# Altium schematic sheet [02] - HAB.SchDoc: HAB
size 433 x 279 mm; Author: ZAG; DrawnBy: ZAG; SheetNumber: 2; SheetTotal: 4; PageSetup: Record=PageOptions|CenterHorizontal=True|CenterVertical=True|PrintScale=0.96|XCorrection=1.00|YCorrection=1.00|PrintKind=2|BorderSize=5000000|LeftOffset=0|BottomOffset=0|Orientation=2|PaperLength=4318|PaperWidth=2794|Scale=100|PaperSource=15|PrintQuality=600|MediaType=1|DitherType=10|PaperKind=11x17|PrintScaleMode=1; SchRevision: 01; PCBRevision: 01; Project: HIGH ALTITUDE BALLOON; SchStatus: PRELIMINARY
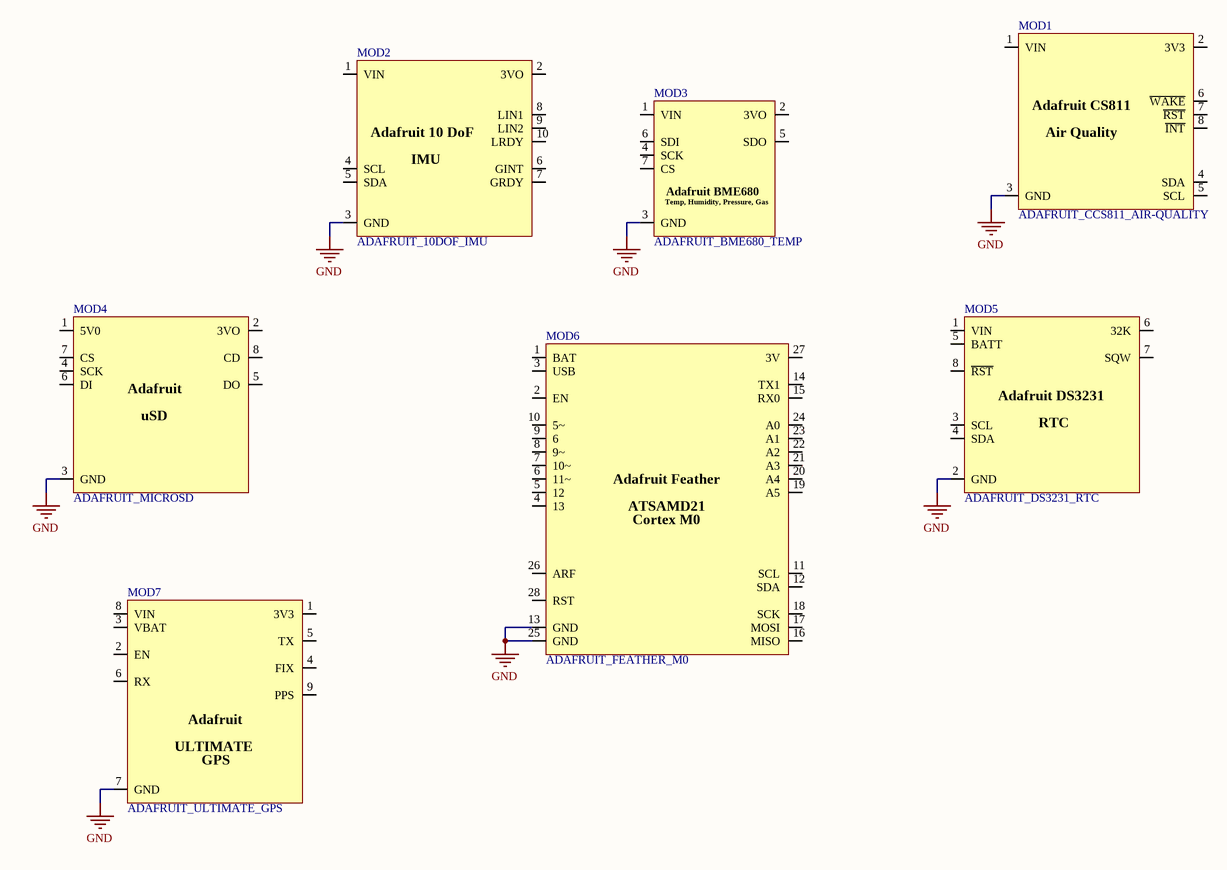
[diagram p0: [02] - HAB.SchDoc]

## Parts
MOD1  ADAFRUIT_CCS811_AIR-QUALITY  [ADAFRUIT_CCS811_AIR-QUALITY]
MOD2  ADAFRUIT_10DOF_IMU  [ADAFRUIT_10DOF_IMU]
MOD3  ADAFRUIT_BME680_TEMP  [ADAFRUIT_BME680_TEMP]
MOD4  ADAFRUIT_MICROSD  [ADAFRUIT_MicroSD]
MOD5  ADAFRUIT_DS3231_RTC  [ADAFRUIT_DS3231_RTC]
MOD6  ADAFRUIT_FEATHER_M0  [ADAFRUIT_FEATHER_M0]
MOD7  ADAFRUIT_ULTIMATE_GPS  [ADAFRUIT_ULTIMATE_GPS]

## Nets
GND: MOD1.3(GND) MOD2.3(GND) MOD3.3(GND) MOD4.3(GND) MOD5.2(GND) MOD6.13(GND) MOD6.25(GND) MOD7.7(GND)

Not connected (* = marked no-connect by the designer): MOD1 1(VIN) 2(3V3) 4(SDA) 5(SCL) 6(~{WAKE}) 7(~{RST}) 8(~{INT}); MOD2 1(VIN) 2(3VO) 4(SCL) 5(SDA) 6(GINT) 7(GRDY) 8(LIN1) 9(LIN2) 10(LRDY); MOD3 1(VIN) 2(3VO) 4(SCK) 5(SDO) 6(SDI) 7(CS); MOD4 1(5V0) 2(3VO) 4(SCK) 5(DO) 6(DI) 7(CS) 8(CD); MOD5 1(VIN) 3(SCL) 4(SDA) 5(BATT) 6(32K) 7(SQW) 8(~{RST}); MOD6 1(BAT) 2(EN) 3(USB) 4(13) 5(12) 6(11~) 7(10~) 8(9~) 9(6) 10(5~) 11(SCL) 12(SDA) 14(TX1) 15(RX0) 16(MISO) 17(MOSI) 18(SCK) 19(A5) 20(A4) 21(A3) 22(A2) 23(A1) 24(A0) 26(ARF) 27(3V) 28(RST); MOD7 1(3V3) 2(EN) 3(VBAT) 4(FIX) 5(TX) 6(RX) 8(VIN) 9(PPS)

## Notes on the sheet
- SHEET TITLE
- SCH REV:
- PROJECT NAME
- PCB REV:
- DATE:
- DRAWN BY
- CONTACT
- MANUFACTURER, OR SALE OF PROCESSES OR PRODUCTS WITHOUT THE EXPRESSED WRITTEN CONSENT OF
- THE INFORMATION CONTAINED HEREIN IS DEEMED TO BE CONFIDENTIAL, PROPRIETARY, AND A TRADE SECRET OF
- THIS INFORMATION MAY NOT BE USED, REPRODUCED, OR DISCLOSED AS THE DIRECT OR INDIRECT BASIS FOR THE DEVELOPMENT,
- SHEET
- MULE LABS, LLC
- www.mule-labs.com <http://www.mule-labs.com>
- OF
- SIZE: B
- DO NOT SCALE DRAWING
- (in symbol ADAFRUIT_10DOF_IMU) Adafruit 10 DoF; IMU
- (in symbol ADAFRUIT_BME680_TEMP) Adafruit BME680; Temp, Humidity, Pressure, Gas
- (in symbol ADAFRUIT_CCS811_AIR-QUALITY) Adafruit CS811; Air Quality
- (in symbol ADAFRUIT_DS3231_RTC) Adafruit DS3231; RTC
- (in symbol ADAFRUIT_FEATHER_M0) Adafruit Feather; ATSAMD21; Cortex M0
- (in symbol ADAFRUIT_MICROSD) Adafruit; uSD
- (in symbol ADAFRUIT_ULTIMATE_GPS) Adafruit; ULTIMATE; GPS